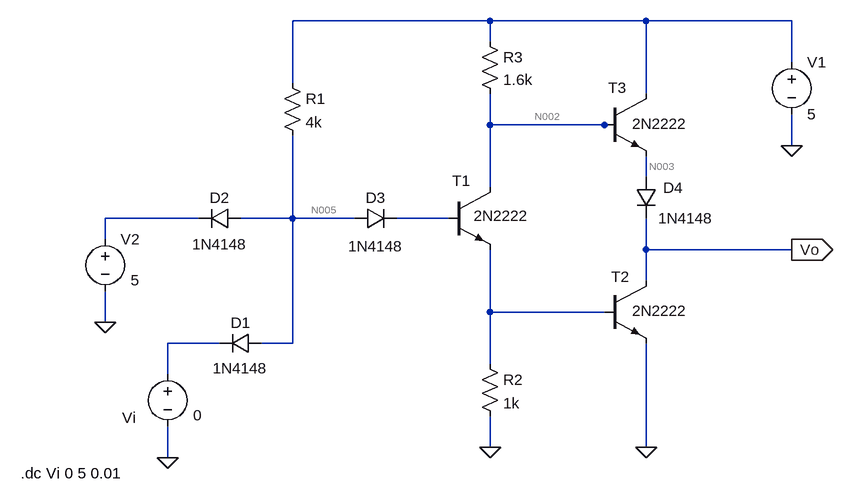
[diagram p0: schematic tema1.asc]
tema1.asc, the LTspice schematic file:
Version 4
SHEET 1 1248 680
WIRE 512 -176 208 -176
WIRE 752 -176 512 -176
WIRE 976 -176 752 -176
WIRE 512 -144 512 -176
WIRE 976 -112 976 -176
WIRE 208 -80 208 -176
WIRE 752 -64 752 -176
WIRE 512 -16 512 -64
WIRE 688 -16 512 -16
WIRE 704 -16 688 -16
WIRE 976 16 976 -32
WIRE 752 64 752 32
WIRE 512 80 512 -16
WIRE 64 128 -80 128
WIRE 208 128 208 0
WIRE 208 128 128 128
WIRE 304 128 208 128
WIRE 448 128 368 128
WIRE -80 160 -80 128
WIRE 752 176 752 128
WIRE 976 176 752 176
WIRE 752 224 752 176
WIRE 512 272 512 176
WIRE 688 272 512 272
WIRE -80 288 -80 240
WIRE 96 320 16 320
WIRE 208 320 208 128
WIRE 208 320 160 320
WIRE 512 352 512 272
WIRE 16 368 16 320
WIRE 512 480 512 432
WIRE 752 480 752 320
WIRE 16 496 16 448
FLAG 512 480 0
FLAG 976 16 0
FLAG 752 480 0
FLAG -80 288 0
FLAG 16 496 0
FLAG 976 176 Vo
IOPIN 976 176 Out
SYMBOL diode 160 304 R90
WINDOW 0 0 32 VBottom 2
WINDOW 3 39 32 VTop 2
SYMATTR InstName D1
SYMATTR Value 1N4148
SYMBOL diode 128 112 R90
WINDOW 0 0 32 VBottom 2
WINDOW 3 40 32 VTop 2
SYMATTR InstName D2
SYMATTR Value 1N4148
SYMBOL diode 304 144 R270
WINDOW 0 32 32 VTop 2
WINDOW 3 -11 32 VBottom 2
SYMATTR InstName D3
SYMATTR Value 1N4148
SYMBOL res 192 -96 R0
SYMATTR InstName R1
SYMATTR Value 4k
SYMBOL res 496 336 R0
SYMATTR InstName R2
SYMATTR Value 1k
SYMBOL res 496 -160 R0
WINDOW 3 36 75 Left 2
SYMATTR InstName R3
SYMATTR Value 1.6k
SYMBOL npn 448 80 R0
WINDOW 0 6 -10 Left 2
WINDOW 3 39 44 Left 2
SYMATTR InstName T1
SYMATTR Value 2N2222
SYMBOL npn 688 224 R0
WINDOW 0 10 -6 Left 2
WINDOW 3 43 46 Left 2
SYMATTR InstName T2
SYMATTR Value 2N2222
SYMBOL voltage 976 -128 R0
WINDOW 123 0 0 Left 2
WINDOW 39 0 0 Left 2
SYMATTR InstName V1
SYMATTR Value 5
SYMBOL voltage -80 144 R0
WINDOW 123 0 0 Left 2
WINDOW 39 0 0 Left 2
WINDOW 3 39 79 Left 2
SYMATTR InstName V2
SYMATTR Value 5
SYMBOL npn 688 -64 R0
WINDOW 0 6 -9 Left 2
WINDOW 3 43 46 Left 2
SYMATTR InstName T3
SYMATTR Value 2N2222
SYMBOL diode 736 64 R0
WINDOW 0 42 17 Left 2
WINDOW 3 35 64 Left 2
SYMATTR InstName D4
SYMATTR Value 1N4148
SYMBOL voltage 16 352 R0
WINDOW 123 0 0 Left 2
WINDOW 39 0 0 Left 2
WINDOW 0 -70 83 Left 2
WINDOW 3 39 79 Left 2
SYMATTR InstName Vi
SYMATTR Value 0
TEXT -210 520 Left 2 !.dc Vi 0 5 0.01

The netlist it stands for:
* tema1.asc
D1 N005 N008 1N4148
D2 N005 N004 1N4148
D3 N005 N006 1N4148
R1 N001 N005 4k
R2 N007 0 1k
R3 N001 N002 1.6k
Q§T1 N002 N006 N007 0 2N2222
Q§T2 Vo N007 0 0 2N2222
V1 N001 0 5
V2 N004 0 5
Q§T3 N001 N002 N003 0 2N2222
D4 N003 Vo 1N4148
Vi N008 0 0
.model D D
.lib standard.dio
.model NPN NPN
.model PNP PNP
.lib standard.bjt
.dc Vi 0 5 0.01
.backanno
.end

* Results of the author's LTspice run, read from the files saved beside the schematic
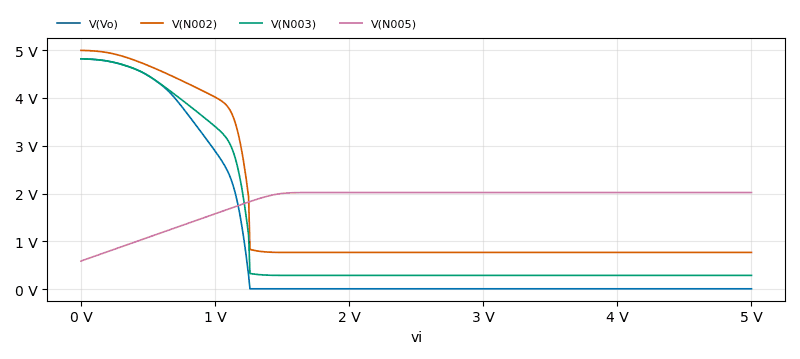
[diagram p1: DC transfer characteristic of tema1.asc, plotted from the saved traces]
* DC transfer characteristic, 1 run:
*   V(Vo): 4.818 V at vi=0 V, 8.239 mV at vi=5 V, min 8.039 mV, max 4.818 V
*   V(N002): 4.995 V at vi=0 V, 769.1 mV at vi=5 V, min 769 mV, max 4.995 V
*   V(N003): 4.818 V at vi=0 V, 288.6 mV at vi=5 V, min 288.5 mV, max 4.818 V
*   V(N005): 589.2 mV at vi=0 V, 2.022 V at vi=5 V, min 589.2 mV, max 2.022 V